# Altium project heading_table.PrjPcb
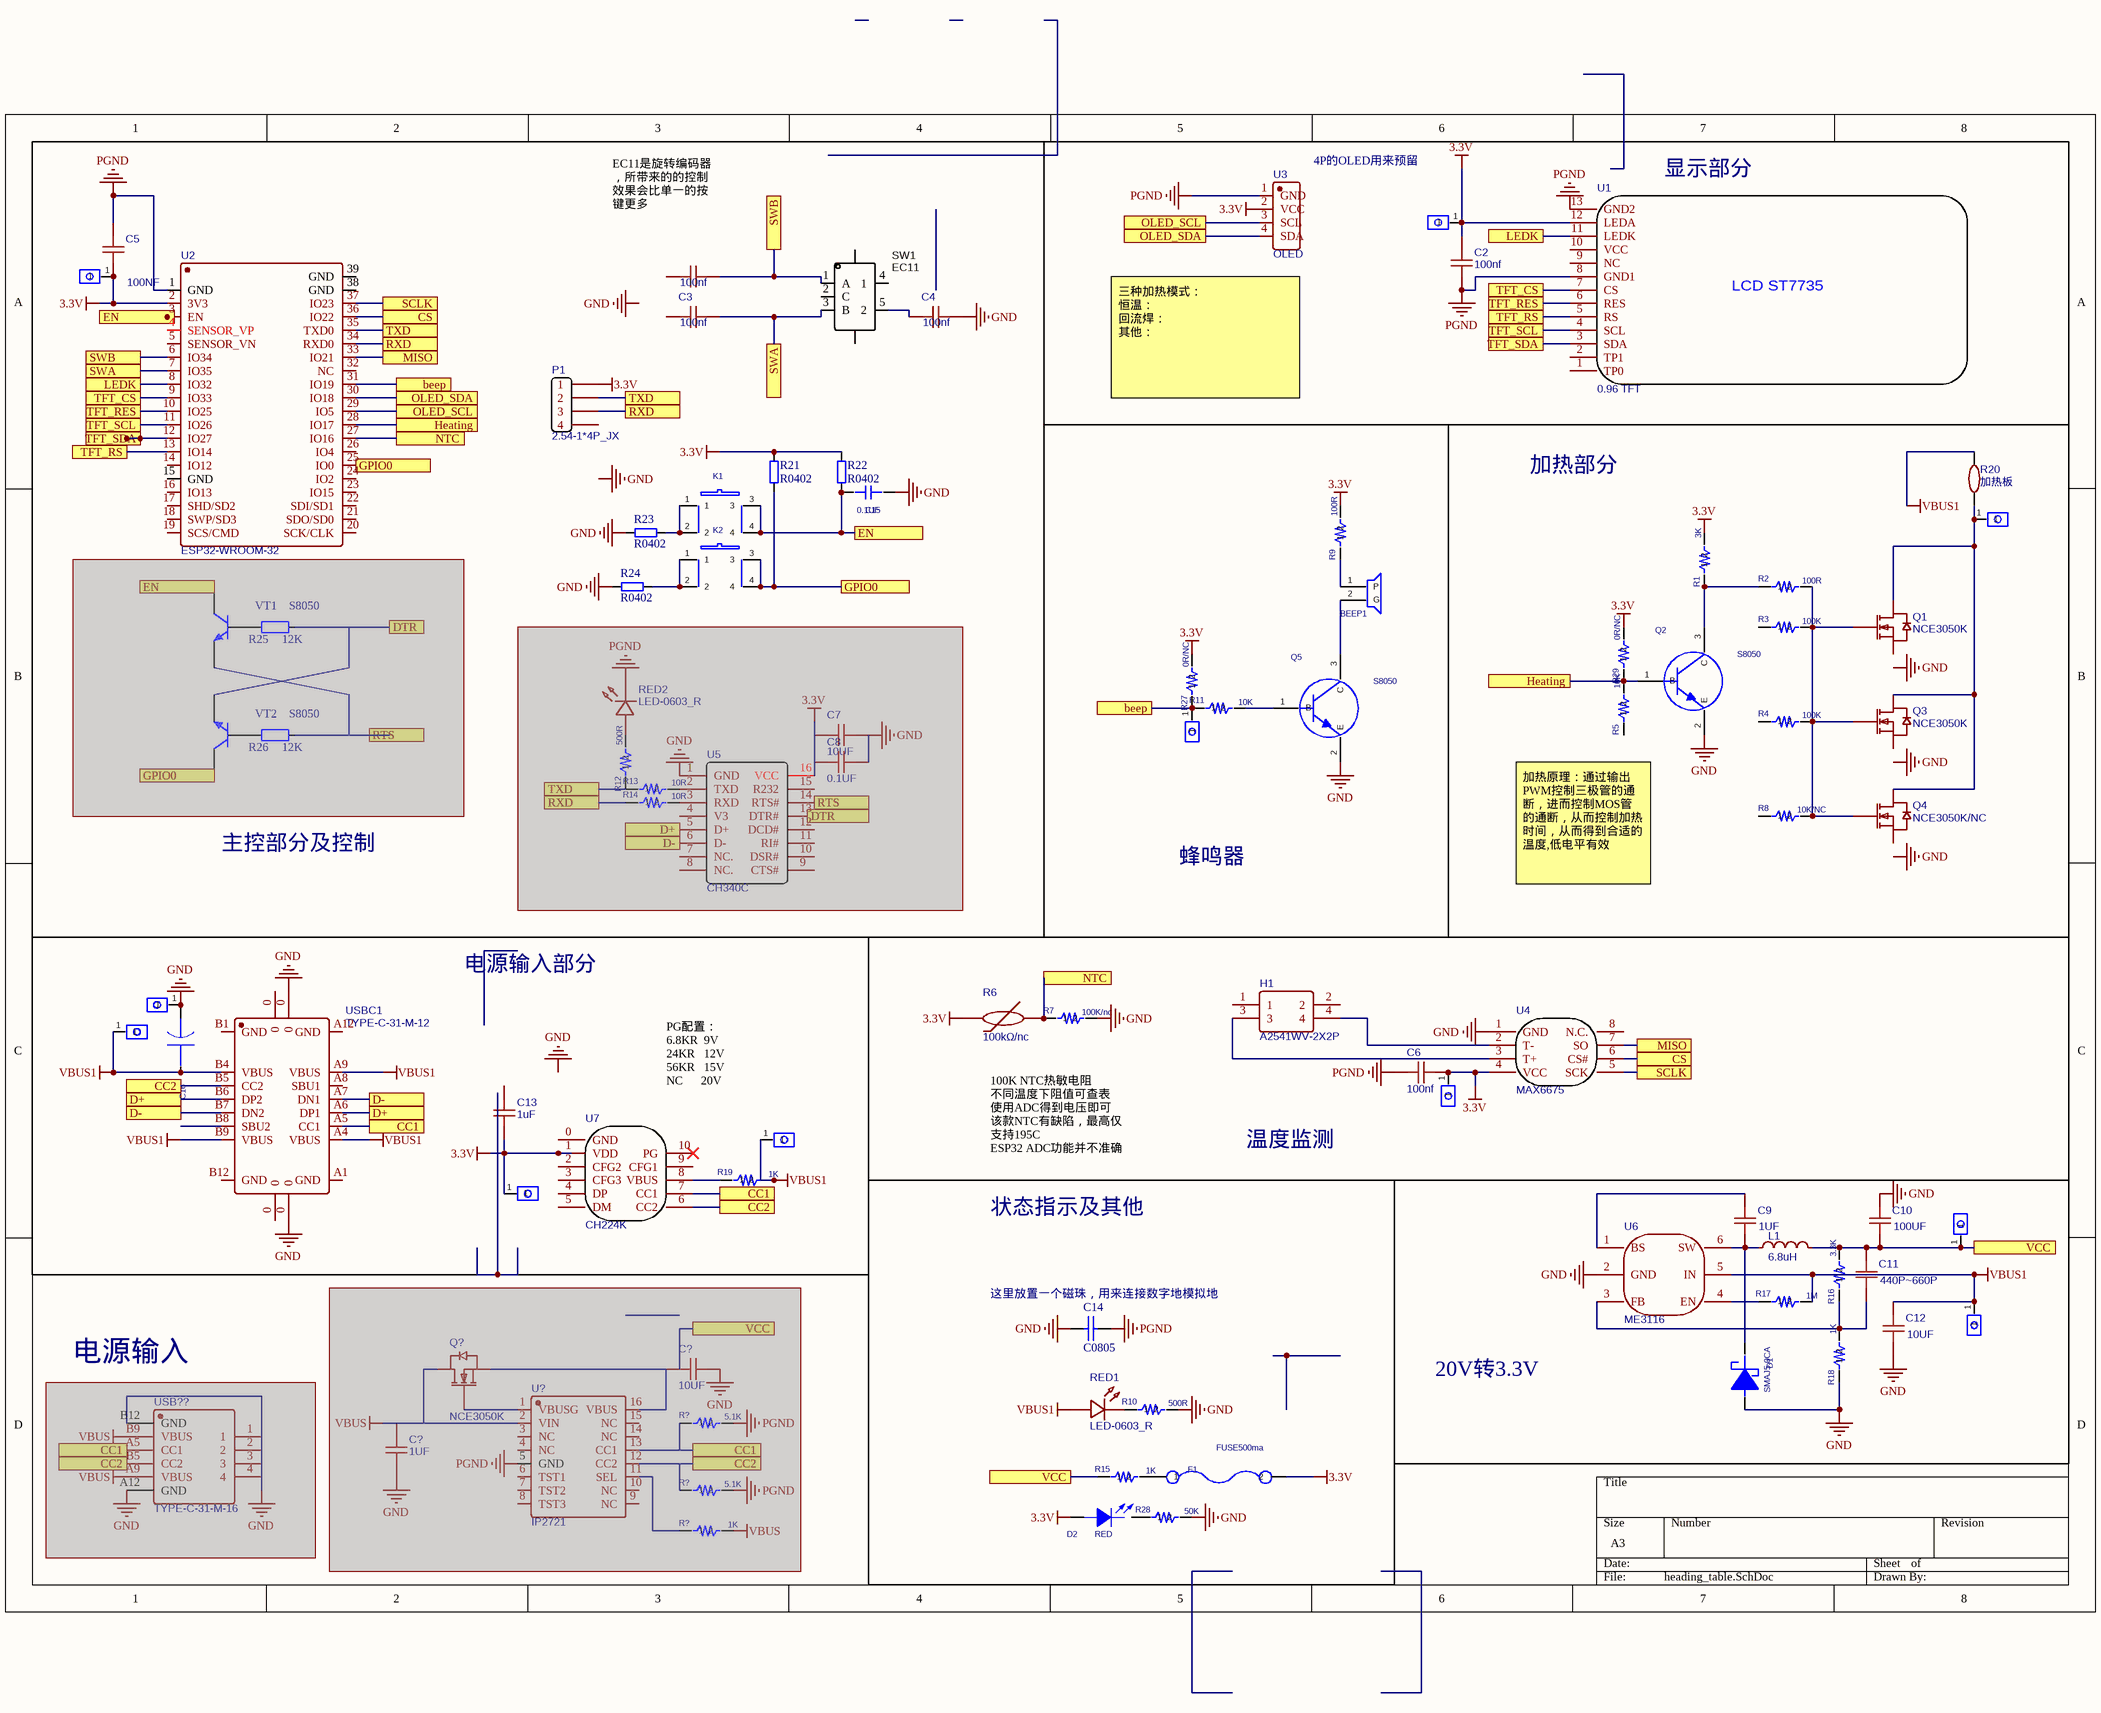
[diagram p0: heading_table.SchDoc]
1 sheet, 91 parts. Net scope: flat (ports and power ports of the same name join across sheets).
Board files: LOGO.PcbDoc, PCB1.PcbDoc

## Sheet heading_table.SchDoc
size A3

### Parts
(Parts that share a designator on the sheet are numbered #1, #2 ... from top to bottom, then left to right.)
BEEP1  BEEP-9.5X5.5  [BUZ-TH_BD12.0-P7.60-D0.6-FD]  (value not drawn)
C1  100nf  [C0603]
C2  100nf  [C0603]
C3  100nf  [C0603]
C4  100nf  [C0603]
C5  100NF  [C0603]
C6  100nf  [C0603]
C7  10UF  [C0603]  (masked out: inside a compile mask, not in the netlist)
C8  0.1UF  [C0603]  (masked out: inside a compile mask, not in the netlist)
C9  1UF  [C0603]
C10  100UF  [C0603]
C11  440P~660P  [C0603]
C12  10UF  [C0603]
C13  1uF  [C0603]
C14  C0805  [C0805]
C15  value 0.1UF  [C0402]  (hidden comment: C0402)
C16  CAP+_47UF_FIRE  [CAP-TH_BD10.0-P5.00-D1.0-FD]  (value not drawn)
C?#1  10UF  [C0603]  (masked out: inside a compile mask, not in the netlist)
C?#2  1UF  [C0603]  (masked out: inside a compile mask, not in the netlist)
D1  SMAJ5.0CA  [DO-214]
D2  value RED  [LED_RED_0603_FIRE]  (hidden comment: LED_RED_0603_FIRE)
F1  FUSE500MA  [C1812]
H1  A2541WV-2X2P  [HDR-TH_4P-P2.54-V-R2-C2-S2.54_A2541WV-2X2P]
J1  1_DIP  [test_point]  (value not drawn)
J2  1_DIP  [test_point]  (value not drawn)
J3  1_DIP  [test_point]  (value not drawn)
J4  1_DIP  [test_point]  (value not drawn)
J5  1_DIP  [test_point]  (value not drawn)
J6  1_DIP  [test_point]  (value not drawn)
J7  1_DIP  [test_point]  (value not drawn)
J8  1_DIP  [test_point]  (value not drawn)
J9  1_DIP  [test_point]  (value not drawn)
J10  1_DIP  [test_point]  (value not drawn)
J11  1_DIP  [test_point]  (value not drawn)
K1  KEY  [SW6.2/6.2-SMD]  (value not drawn)
K2  KEY  [SW6.2/6.2-SMD]  (value not drawn)
L1  6.8uH  [IND-SMD_L4.0-W4.0]
P1  2.54-1*4P_JX  [2.54-1*4P_TIGHT_JX]
Q1  NCE3050K  [TO-252-2_L6.6-W6.1-P4.57-LS10.1-TL-CW]
Q2  S8050  [SOT-23]
Q3  NCE3050K  [TO-252-2_L6.6-W6.1-P4.57-LS10.1-TL-CW]
Q4  NCE3050K/NC  [TO-252-2_L6.6-W6.1-P4.57-LS10.1-TL-CW]
Q5  S8050  [SOT-23]
Q?  NCE3050K  [TO-252-2_L6.6-W6.1-P4.57-LS10.1-TL-CW]  (masked out: inside a compile mask, not in the netlist)
R1  value 3K  [R_0603]  (hidden comment: R0603)
R2  value 100R  [R_0603]  (hidden comment: R0603)
R3  value 100K  [R_0603]  (hidden comment: R0603)
R4  value 100K  [R_0603]  (hidden comment: R0603)
R5  value 10K  [R_0603]  (hidden comment: R0603)
R6  100kΩ/nc  [RES-TH_BD1.8-L4.0-P8.00-D0.5]
R7  value 100K/nc  [R_0603]  (hidden comment: R0603)
R8  value 10K/NC  [R_0603]  (hidden comment: R0603)
R9  value 100R  [R_0603]  (hidden comment: R0603)
R10  value 500R  [R_0603]  (hidden comment: R0603)
R11  value 10K  [R_0603]  (hidden comment: R0603)
R12  value 500R  [R_0603]  (hidden comment: R0603)  (masked out: inside a compile mask, not in the netlist)
R13  value 10R  [R_0603]  (hidden comment: R0603)  (masked out: inside a compile mask, not in the netlist)
R14  value 10R  [R_0603]  (hidden comment: R0603)  (masked out: inside a compile mask, not in the netlist)
R15  value 1K  [R_0603]  (hidden comment: R0603)
R16  value 3.3K  [R_0603]  (hidden comment: R0603)
R17  value 1M  [R_0603]  (hidden comment: R0603)
R18  value 1K  [R_0603]  (hidden comment: R0603)
R19  value 1K  [R_0603]  (hidden comment: R0603)
R20  加热板  [R2512]
R21  R0402  [R0402]
R22  R0402  [R0402]
R23  R0402  [R0402]
R24  R0402  [R0402]
R25  12K  [R0402]  (masked out: inside a compile mask, not in the netlist)
R26  12K  [R0402]  (masked out: inside a compile mask, not in the netlist)
R27  value 0R/NC  [R_0603]  (hidden comment: R0603)
R28  value 50K  [R0805]  (hidden comment: R0603)
R29  value 0R/NC  [R_0603]  (hidden comment: R0603)
R?#1  value 5.1K  [R_0603]  (hidden comment: R0603)  (masked out: inside a compile mask, not in the netlist)
R?#2  value 5.1K  [R_0603]  (hidden comment: R0603)  (masked out: inside a compile mask, not in the netlist)
R?#3  value 1K  [R_0603]  (hidden comment: R0603)  (masked out: inside a compile mask, not in the netlist)
RED1  LED-0603_R  [LED0603_RED]
RED2  LED-0603_R  [LED0603_RED]  (masked out: inside a compile mask, not in the netlist)
SW1  EC11  [SW-TH_5P-L11.8-W12.0-P2.50-LS14.5]
U1  0.96 TFT  [0.96 LCD]
U2  ESP32-WROOM-32  [WIFIM-SMD_ESP-32S]
U3  OLED  [HDR-TH_4P-P2.54-V-M]
U4  MAX6675  [SOIC-8_L5.0-W4.0-P1.27-LS6.0-BL]
U5  CH340C  [SOP-16_L10.0-W3.9-P1.27-LS6.0-BL]  (masked out: inside a compile mask, not in the netlist)
U6  ME3116  [SOT-23-6_L2.9-W1.6-P0.95-LS2.8-BR]
U7  CH224K  [ESSOP10-EP]
U?  IP2721  [TSSOP-16_L5.0-W4.4-P0.65-LS6.4-BL]  (masked out: inside a compile mask, not in the netlist)
USB??  TYPE-C-31-M-16  [TYPE-C-SMD_TYPE-C-31-M-16]  (masked out: inside a compile mask, not in the netlist)
USBC1  TYPE-C-31-M-12  [USB-C_SMD-TYPE-C-31-M-12]
VT1  S8050  [SOT-23]  (masked out: inside a compile mask, not in the netlist)
VT2  S8050  [SOT-23]  (masked out: inside a compile mask, not in the netlist)

### Blocks framed on the sheet
主控部分及控制: C1 C3-C5 C7 C8 C15 J3 K1 K2 P1 R12-R14 R21-R26 RED2 SW1 U2 U5 VT1 VT2
20V转3.3V: C9-C12 D1 J7 J9 L1 R16-R18 U6

### Ports
beep, CC1, CC2, CS, D+, D-, DTR, EN, GPIO0, Heating, LEDK, MISO, NTC, OLED_SCL, OLED_SDA, RTS, RXD, SCLK, SWA, SWB, TFT_CS, TFT_RES, TFT_RS, TFT_SCL, TFT_SDA, TXD, VCC

### Nets
3.3V: C2.2 C5.2 C6.1 C13.1 D2.A(ANODE) F1.2 J1.1 J3.1 J5.1 J11.1 P1.1 R1.2 R6.1 R9.2 R21.2 R22.2 R27.2 R29.2 U1.12(LEDA) U2.2(3V3) U3.2(VCC) U4.4(VCC) U7.1(VDD)
GND: C4.1 C10.1 C12.2 C14.1 C15.1 C16.2 D1.1(+) J8.1 Q2.2(E) Q5.2(E) R7.2 R10.2 R18.1 R23.1 R24.1 R28.2 U4.1(GND) U6.2(GND) USBC1.0
PGND: C2.1 C5.1 C6.2 C14.2 U1.8(GND1) U1.13(GND2) U2.1(GND) U3.1(GND)
VBUS1: C12.1 C16.1 J4.1 J9.1 J10.1 R17.2 R19.2 R20.2 RED1.1 U6.5(IN) USBC1.A4(VBUS) USBC1.A9(VBUS) USBC1.B4(VBUS) USBC1.B9(VBUS)
NetBEEP1_1: BEEP1.1(P) R9.1
NetBEEP1_2: BEEP1.2(G) Q5.3(C)
NetC1_1: C1.1 SW1.1(A) U2.6(IO34) ; port SWB
NetC3_1: C3.1 SW1.3(B) U2.7(IO35) ; port SWA
NetC4_2: C4.2 SW1.5(2)
NetC9_1: C9.1 U6.1(BS)
NetC9_2: C9.2 D1.2(-) L1.1 U6.6(SW)
NetC10_2: C10.2 C11.1 J7.1 L1.2 R15.1 R16.2 ; port VCC
NetC11_2: C11.2 R16.1 R18.2 U6.3(FB)
NetC15_2: C15.2 K1.3 K1.4 R22.1 ; port EN
NetD2_K: D2.K(CATHODE) R28.1
NetF1_1: F1.1 R15.2
NetH1_3: H1.3 U4.3(T+)
NetH1_4: H1.4 U4.2(T-)
NetJ2_1: J2.1 Q1.2(D) Q3.2(D) Q4.2(D) R20.1
NetJ6_1: J6.1 R11.1 R27.1 U2.31(IO19) ; port beep
NetK1_1: K1.1 K1.2 R23.2
NetK2_1: K2.1 K2.2 R24.2
NetK2_3: K2.3 K2.4 R21.1 U2.25(IO0) ; port GPIO0
NetP1_2: P1.2 U2.35(TXD0) ; port TXD
NetP1_3: P1.3 U2.34(RXD0) ; port RXD
NetQ1_1: Q1.1(G) Q3.1(G) Q4.1(G) R2.2 R3.2 R4.2 R8.2
NetQ2_1: Q2.1(B) R5.2 R29.1 U2.28(IO17) ; port Heating
NetQ2_3: Q2.3(C) R1.1 R2.1
NetQ5_1: Q5.1(B) R11.2
NetR6_2: R6.2 R7.1 U2.27(IO16) ; port NTC
NetR10_1: R10.1 RED1.2
NetR17_1: R17.1 U6.4(EN)
NetR19_1: R19.1 U7.8(VBUS)
NetU1_3: U1.3(SDA) U2.12(IO27) ; port TFT_SDA
NetU1_4: U1.4(SCL) U2.11(IO26) ; port TFT_SCL
NetU1_5: U1.5(RS) U2.13(IO14) ; port TFT_RS
NetU1_6: U1.6(RES) U2.10(IO25) ; port TFT_RES
NetU1_7: U1.7(CS) U2.9(IO33) ; port TFT_CS
NetU1_11: U1.11(LEDK) U2.8(IO32) ; port LEDK
NetU2_29: U2.29(IO5) U3.3(SCL) ; port OLED_SCL
NetU2_30: U2.30(IO18) U3.4(SDA) ; port OLED_SDA
NetU2_33: U2.33(IO21) U4.7(SO) ; port MISO
NetU2_36: U2.36(IO22) U4.6(CS#) ; port CS
NetU2_37: U2.37(IO23) U4.5(SCK) ; port SCLK
NetU7_6: U7.6(CC2) USBC1.B5(CC2) ; port CC2
NetU7_7: U7.7(CC1) USBC1.A5(CC1) ; port CC1
NetUSBC1_A6: USBC1.A6(DP1) USBC1.B6(DP2) ; port D+
NetUSBC1_A7: USBC1.A7(DN1) USBC1.B7(DN2) ; port D-

Not connected (* = marked no-connect by the designer): C1 2; C3 2; C13 2; H1 1 2; P1 4; Q1 3(S); Q3 3(S); Q4 3(S); R3 1; R4 1; R5 1; R8 1; SW1 2(C) 4(1) 7 8; U1 1(TP0) 2(TP1) 9(NC) 10(VCC); U2 3(EN) 4(SENSOR_VP) 5(SENSOR_VN) 14(IO12) 15(GND) 16(IO13) 17(SHD/SD2) 18(SWP/SD3) 19(SCS/CMD) 20(SCK/CLK) 21(SDO/SD0) 22(SDI/SD1) 23(IO15) 24(IO2) 26(IO4) 32(NC) 38(GND) 39(GND); U4 8(N.C.); U7 0(GND) 2(CFG2) 3(CFG3) 4(DP) 5(DM) 9(CFG1) 10(PG)*; USBC1 A1(GND) A8(SBU1) A12(GND) B1(GND) B8(SBU2) B12(GND)

### Notes on the sheet
- (near U3) 4P的OLED用来预留
- 显示部分
- (near C1) EC11是旋转编码器，所带来的的控制效果会比单一的按键更多
- (near U3) 三种加热模式：
  恒温：
  回流焊：
  其他：
- 加热部分
- 蜂鸣器
- 加热原理：通过输出PWM控制三极管的通断，进而控制MOS管的通断，从而控制加热时间，从而得到合适的温度,低电平有效
- 电源输入部分
- PG配置：
  6.8KR  9V
  24KR   12V
  56KR   15V
  NC      20V
- 100K NTC热敏电阻
  不同温度下阻值可查表
  使用ADC得到电压即可
  该款NTC有缺陷，最高仅支持195C
  ESP32 ADC功能并不准确
- 温度监测
- 状态指示及其他
- (near C14) 这里放置一个磁珠，用来连接数字地模拟地
- 电源输入
- Labels drawn without touching a wire or pin: GND
- (in symbol 0.96 TFT) LCD ST7735

### Library data of the parts
C1-C6 C8-C11 C13 C?#2 = C0603: BOM_Manufacturer: Samsung Electro-Mechanics; BOM_Manufacturer Part: 10uF; nameAlias: Value; Contributor: LCSC; BOM_Supplier: LCSC; BOM_Supplier Part: C15415; spicePre: C; spiceSymbolName: 10UF
C7 C12 C?#1 = C0603: BOM_Manufacturer: Samsung Electro-Mechanics; nameAlias: Value; Contributor: LCSC; BOM_Supplier: LCSC; BOM_Supplier Part: C15415; BOM_Manufacturer Part: 10uF; spicePre: C; spiceSymbolName: 10UF
C14 = C0805: Capacitor
C15 = C0402: PCB DECAL: CAP_0603_FIRE
C16 = CAP+_47UF_FIRE: 电解电容; PCB DECAL: CAP+_47UF_FIRE
D1 = SMAJ5.0CA: 500V  400W 稳压管; PCB DECAL: DO-214; Value: SMAJ5.0CA
D2 = LED_RED_0603_FIRE: red,0805; PCB DECAL: LED_RED_0603_FIRE
F1 = FUSE500MA: Assembly: SMD; Protel.FootprintDescription: Chip Capacitor, 2-Leads, Body 4.6x3.2mm, IP; Manufacture 1 P/N: FUSE500ma; PCB DECAL: C1812; Value: FUSE500ma
H1 = 2X2P: BOM_Manufacturer: Changjiang Connectors; Contributor: LCSC; BOM_Supplier: LCSC; BOM_Supplier Part: C225517; BOM_Manufacturer Part: A2541WV-2x2P; BOM_JLCPCB Part Class: Extended Part; spicePre: H; spiceSymbolName: A2541WV-2X2P
J1-J11 = test_point: PCB DECAL: 1_DIP
L1 = 6.8uH: BOM_Manufacturer: LCSC; BOM_Manufacturer Part: SM1054-6R8MT; nameAlias: Value; BOM_Supplier: LCSC; BOM_Supplier Part: C11034; spicePre: L; spiceSymbolName: 6.8uH
Q1 Q3 Q4 Q? = NCE3050K: BOM_Manufacturer: Ncepower; BOM_Supplier: LCSC; BOM_Manufacturer Part: NCE3050K; BOM_Supplier Part: C127863; BOM_JLCPCB Part Class: Extended Part; spicePre: Q; spiceSymbolName: NCE3050K
Q2 Q5 = S8050: NPN; Manufacturer #2: 8050; PCB DECAL: SOT-23
R6 = NTC 100kΩ: BOM_Manufacturer: Shiheng; BOM_Manufacturer Part: MF58-104J3950F; nameAlias: Value; BOM_Supplier: LCSC; BOM_Supplier Part: C84686; BOM_JLCPCB Part Class: Extended Part; spicePre: R; spiceSymbolName: MF58-104J3950F
R20 = R2501: BOM_Manufacturer Part: MRF6432(2512)LR010JTS; BOM_Manufacturer: SUP; Value: 0.01Ω; SMT Type: Extend; BOM_Supplier Part: C76272; BOM_Supplier: LCSC; image: http://image.lceda.cn/szlcsc/C76272.jpg; BOM_JLCPCB SMD: Yes; spicePre: R; spiceSymbolName: MRF6432(2512)LR010JTS
R25 R26 = 电阻-0402: Resistor; Value: 22R
R28 = R0603: PCB DECAL: R_0603
RED1 RED2 = LED-0603_R: BOM_Manufacturer: EVERLIGHT(台湾亿光); BOM_Manufacturer Part: 19-217/R6C-AL1M2VY/3T; Contributor: LCEDA_01; BOM_Supplier Part: C72044; BOM_Supplier: LCSC; spicePre: L; spiceSymbolName: LED-0603_R
SW1 = EC11: BOM_Manufacturer: BOURNS; BOM_Manufacturer Part: PEC11L-4115F-S0020; Contributor: LCSC; BOM_Supplier: LCSC; BOM_Supplier Part: C143799; BOM_JLCPCB Part Class: Extended Part; spicePre: S; spiceSymbolName: PEC11L-4115F-S0020
U1 = 0.96 TFT: Contributor: FJ956391150; spicePre: U; spiceSymbolName: 0.96 TFT
U2 = ESP32-WROOM-32: BOM_Manufacturer: Espressif Systems; Contributor: LCSC; BOM_Supplier: LCSC; BOM_Supplier Part: C82899; BOM_Manufacturer Part: ESP32-WROOM-32; BOM_JLCPCB Part Class: Extended Part; spicePre: U; spiceSymbolName: ESP32-WROOM-32
U3 = OLED module: BOM_Manufacturer: kinghelm(金航标); BOM_Manufacturer Part: KH-2.54PH180-1X4P-L11.5; Contributor: LCSC; BOM_Supplier: LCSC; BOM_Supplier Part: C2905435; spicePre: H; spiceSymbolName: KH-2.54PH180-1X4P-L11.5
U4 = MAX6675: BOM_Manufacturer: MAXIM; BOM_Manufacturer Part: MAX6675ISA+T; SMT Type: Extend; Package Display: No; BOM_Supplier: LCSC; image: //image.lceda.cn/szlcsc/C16030.jpg; BOM_Supplier Part: C16030; BOM_LCSC Assembly: Yes; spicePre: U; spiceSymbolName: MAX6675ISA+T
U5 = CH340C: BOM_Manufacturer: WCH; BOM_Supplier: LCSC; BOM_Manufacturer Part: CH340C; BOM_Supplier Part: C84681; BOM_JLCPCB Part Class: Extended Part; spicePre: U; spiceSymbolName: CH340C
U6 = ME3116: BOM_Manufacturer: MICRONE; BOM_Supplier: LCSC; BOM_Manufacturer Part: ME3116; BOM_Supplier Part: C97643; BOM_JLCPCB Part Class: Extended Part; spicePre: U; spiceSymbolName: ME3116
U7 = CH224K: BOM_Manufacturer: 南京沁恒微电子; Contributor: hans_1024; spicePre: U; spiceSymbolName: CH224K
U? = IP2721: BOM_Manufacturer: INJOINIC; Contributor: LCSC; BOM_Supplier: LCSC; BOM_Supplier Part: C603176; BOM_Manufacturer Part: IP2721; BOM_JLCPCB Part Class: Extended Part; spicePre: U; spiceSymbolName: IP2721
USB?? = TYPE-C-31-M-16: BOM_Manufacturer: Korean Hroparts Elec; Contributor: LCSC; BOM_Supplier: LCSC; BOM_Supplier Part: C283541; BOM_Manufacturer Part: TYPE-C-31-M-16; BOM_JLCPCB Part Class: Extended Part; spicePre: U; spiceSymbolName: TYPE-C-31-M-16
USBC1 = TYPE-C-31-M-12: BOM_Manufacturer: Rectangular Connectors - Contacts; Contributor: LCSC; BOM_Supplier: LCSC; BOM_Supplier Part: C165948; BOM_Manufacturer Part: TYPE-C-31-M-12; spicePre: U; spiceSymbolName: TYPE-C-31-M-12
VT1 VT2 = SMT_TRIODE_NPN: Surface mount NPN transistor, package SOT-23
BEEP1 = BEEP-9.5X5.5: PCB DECAL: BEEP-9.5X5.5
K1 K2 = KEY: Manufacturer #1 PN: KEY; PCB DECAL: SW6.2/6.2-SMD
P1 = 2.54-1*4P_JX: BOM_Supplier Part: C115245; BOM_Supplier: LCSC; spicePre: P; spiceSymbolName: 2.54-1*4P_JX
R1-R5 R7-R19 R27 R29 R?#1-R?#3 = R0603: PCB DECAL: R_0603